# Altium project PD_Controller_Wall_Following_Robo.PrjPcb
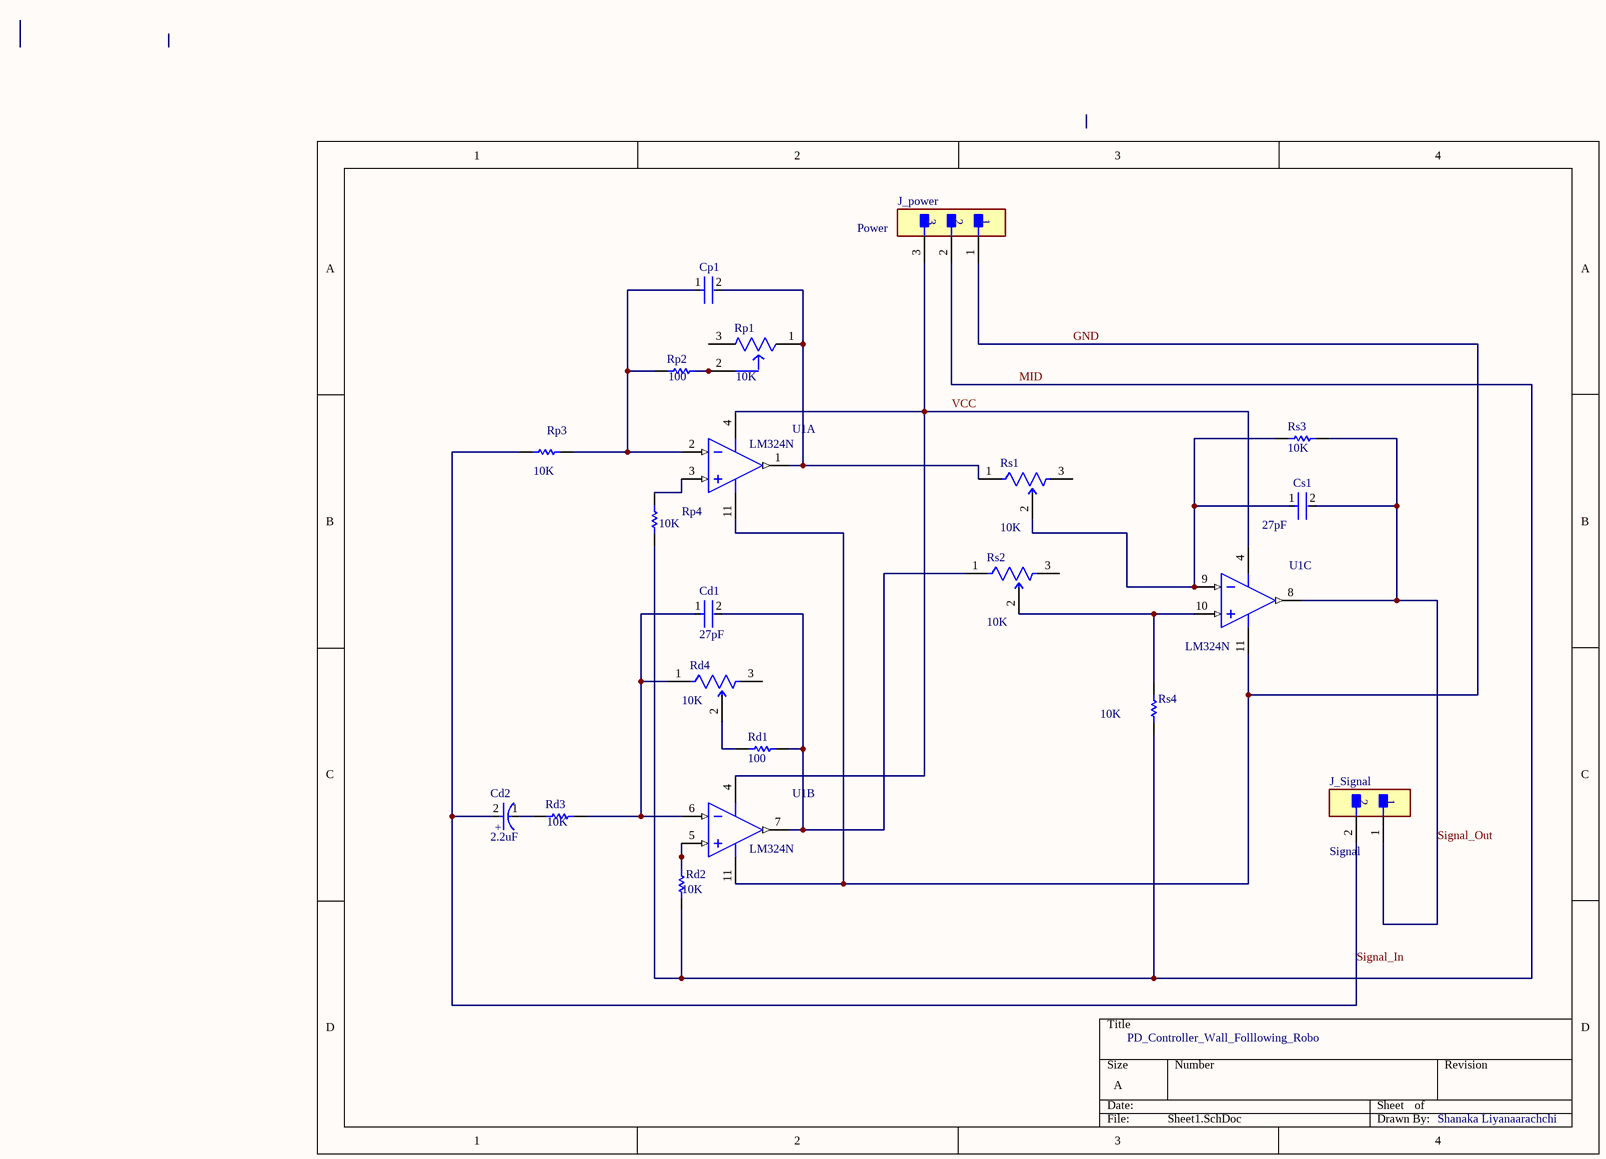
[diagram p0: Sheet1.SchDoc]
1 sheet, 19 parts. Net scope: global (net labels, ports and power ports of the same name join across sheets).
Board file: PD_Controller_Wall_Following_Robo_1.PcbDoc

## Sheet Sheet1.SchDoc
size A; SheetNumber: 1; SheetTotal: 1

### Parts
Cd1  27pF  [FP-RCE0K1-MFG]
Cd2  2.2uF  [FP-RAD-TH-D_5_0_5-L_11_1-MFG]
Cp1  (no value)  [FP-RCE0K1-MFG]
Cs1  27pF  [FP-RCE0K1-MFG]
J_power  Power  [FP-B3B-XH-A_LF_SN-MFG]
J_Signal  Signal  [FP-B2B-XH-A_LF_SN-MFG]
Rd1  100  [RESA60-630X240]
Rd2  10K  [OMTE-RES7X2.5-2]
Rd3  10K  [OMTE-RES7X2.5-2]
Rd4  10K  [FP-3296W-MFG]
Rp1  10K  [FP-3266W-MFG]
Rp2  100  [RESA60-630X240]
Rp3  10K  [OMTE-RES7X2.5-2]
Rp4  10K  [OMTE-RES7X2.5-2]
Rs1  10K  [FP-3296W-MFG]
Rs2  10K  [FP-3296W-MFG]
Rs3  10K  [OMTE-RES7X2.5-2]
Rs4  10K  [OMTE-RES7X2.5-2]
U1  LM324N  [N0014A]  (parts A,B,C of 4)

### Nets
GND: J_power.1 U1.11(GND)
MID: J_power.2 Rd2.1 Rp4.1 Rs4.1
Signal_In: Cd2.2(A) J_Signal.2 Rp3.1
Signal_Out: Cs1.2 J_Signal.1 Rs3.2 U1.8(OUT3)
VCC: J_power.3 U1.4(V+)
NetCd1_1: Cd1.1 Rd3.2 Rd4.1(CCW) U1.6(IN2-)
NetCd1_2: Cd1.2 Rd1.2 Rs2.1(CCW) U1.7(OUT2)
NetCd2_1: Cd2.1(C) Rd3.1
NetCp1_1: Cp1.1 Rp2.1 Rp3.2 U1.2(IN1-)
NetCp1_2: Cp1.2 Rp1.1(CCW) Rs1.1(CCW) U1.1(OUT1)
NetCs1_1: Cs1.1 Rs1.2(WIPER) Rs3.1 U1.9(IN3-)
NetRd1_1: Rd1.1 Rd4.2(WIPER)
NetRd2_2: Rd2.2 U1.5(IN2+)
NetRp1_2: Rp1.2(WIPER) Rp2.2
NetRp4_2: Rp4.2 U1.3(IN1+)
NetRs2_2: Rs2.2(WIPER) Rs4.2 U1.10(IN3+)

Not connected (* = marked no-connect by the designer): Rd4 3(CW); Rp1 3(CW); Rs1 3(CW); Rs2 3(CW)

### Notes on the sheet
- PD_Controller_Wall_Folllowing_Robo
- Shanaka Liyanaarachchi
- (in symbol CMP-05427-000832-1) +

### Library data of the parts
Cd1 Cp1 Cs1 = CMP-06035-026251-1: Cap Ceramic 27pF 50V C0G ±5% Radial 5mm +125°C Automotive Bulk; Lead Diameter: 0.5mm; Lead/Base Style: Formed Leads; Height: 3.5mm; Mount: Through Hole; Height - Seated (Max): 0.138inch; Min Operating Temperature: -55°C; Package Quantity: 1; Width: 0.098inch; Lead Pitch: 0.197inch; Capacitance: 27pF; Voltage Rating: 50V; Max Operating Temperature: 125°C; Case/Package: Radial; Termination: Radial; Voltage Rating (DC): 50V; Packaging: Tape and Reel; Tolerance: 5%; Resistor Type: Ceramic; Dielectric: C0G; Length: 0.142inch; Ratings: AEC-Q200
Cd2 = CMP-05427-000832-1: Aluminum Electrolytic Capacitors (Radial Lead Type) AEC-Q200 Qualified 2.2uF ±20% 50V; Lead/Base Style: Straight; Ripple Current: 18mA; Lead Diameter: 0.5mm; Life (Hours): 1000Hour; Packaging: Tape and Reel; Case/Package: Radial; Tolerance: 20%; Series: NHG; Lead Pitch: 5mm; Package Quantity: 2000; Voltage Rating: 50V; Diameter: 5mm; Length: 11mm; Min Operating Temperature: -55°C; RoHS Compliant: Yes; Voltage Rating (DC): 50V; Height - Seated (Max): 0.472inch; Max Operating Temperature: 105°C; Mount: Through Hole; Radiation Hardening: No; Capacitance: 2.2uF; Height: 11mm; Termination: Radial
J_power = CMP-17439-000014-3: CONN HEADER VERT 3POS 2.5MM; Max Voltage Rating (DC): 250V; Number of Positions: 3; Current Rating: 3A; Gender: Male; Wire/Cable Gauge: 22AWG; Contact Resistance: 20mR; Insulation Resistance: 1GR; Insulation Material: Nylon; Contact Plating: Tin; Depth: 5.75mm; Contact Type: Male Pin; Max Operating Temperature: 85°C; Insulation Color: Natural; Voltage Rating (AC): 250V; Color: Natural; Connector Type: Header; Orientation: Straight; Fastening Type: Detent; Housing Color: White; Min Operating Temperature: -25°C; Termination: Solder; Voltage Rating: 250V; Series: XH; Pitch: 2.5mm; Contact Shape: Square; Number of Rows: 1; Lead Free: Lead Free; Packaging: Bulk; Mount: Through Hole; Flammability Rating: UL94 V-0; Max Voltage Rating (AC): 250V; REACH SVHC: No SVHC; Housing Material: Polyamide; Contact Material: Brass; Lead Pitch: 2.5mm; Contact Finish - Mating: TIN; Length: 9.9mm; Max Current Rating: 3A; Number of Contacts: 3
J_Signal = CMP-2000-05888-3: CONN HEADER VERT 2POS 2.5MM; Current Rating: 3A; Voltage Rating: 250V; Number of Contacts: 2; Contact Resistance: 20mR; Wire/Cable Gauge: 22AWG; Insulation Resistance: 1GR; Connector Type: Male Pin; Packaging: Bulk; Contact Material: Brass; Lead Free: Lead Free; Orientation: Straight; Contact Plating: Tin; Max Current Rating: 3A; Termination: Solder; Fastening Type: Detent; Depth: 5.75mm; Housing Material: Polyamide; REACH SVHC: No SVHC; Series: XH; Voltage Rating (AC): 250V; Number of Positions: 2; Color: Natural; Contact Type: Male Pin; Max Voltage Rating (DC): 250V; Pitch: 2.5mm; Lead Pitch: 2.5mm; Mount: Through Hole; Max Operating Temperature: 85°C; Length: 7.4mm; Max Voltage Rating (AC): 250V; Min Operating Temperature: -25°C; Number of Rows: 1; Housing Color: White
Rd1 Rp2 = CMP-1659-00071-1: Axial Resistor, 100 Ohm, +/- 1%, 0.25 W, -55 to 155 degC, 2-Pin THD, RoHS, Bulk; Voltage Rating: 250 V; Resistance: 4.75 kohm; Power Rating: 250 mW; Type (Resistor): Metal Film; Package Quantity: 200; RoHSCompliant: true; ComponentLink1URL: http://www.yageo.com/; ComponentLink1Description: Manufacturer URL; Case\Package: Axial; ComponentLink2Description: Datasheet; Length: 0.248 inch; PackageReference: MFR-25; Max Operating Temperature: 155 degC; Min Operating Temperature: -55 degC; DatasheetVersion: Apr-13; Mount: Through Hole; PackageDescription: 2-Pin Axial Lead, Dia 2.4 mm, Body Length 6.3 mm; Packaging: Bulk; Tolerance: 1%; ComponentLink2URL: http://www.yageo.com/documents/recent/Yageo%20LR_MFR_2013.pdf
Rd2 Rd3 Rp3 Rp4 Rs3 Rs4 = CMP-2000-06865-1: Little Demon(R) Carbon Composition Molded OD Series, 250 V, 10 KOhm, +/-5%, -70 to 130 degC, 2-Pin THD, RoHS, Bulk; PartNumber: OD103JE; Manufacturer: Ohmite; Power Rating: 0.25W; Power (Watts): 0.25W,1/4W; Tolerance: ±5%; Online Catalog: OD,OF,OASeries,LittleDemon®; Catalog Drawings: OD,OF,OASeries; EDA / CAD Models: DownloadfromAcceleratedDesigns; Mounting Technology: ThroughHole; Datasheet Version: 06/2016; RoHS Information: LittleDemon"E"SeriesMaterialDeclaration; Number of Terminations: 2; Temperature Coefficient: -; Height: -; Resistance (Ohms): 10k; Composition: CarbonComposition; Package Description: 2-Pin THD Resistor, Body 7 x 2.5 mm, Lead Dia. 0.6 mm; Size / Dimension: 0.098"Diax0.276"L(2.50mmx7.00mm); Category: Resistors; Manufacturer URL: http://www.ohmite.com/; Features: PulseWithstanding; Family: ThroughHoleResistors; Supplier Device Package: Axial; Package / Case: Axial; Standard Package: 100; Package Reference: RES7X2.5; Operating Temperature: -; Series: LittleDemon®OD; Datasheet URL: http://www.ohmite.com/cat/res_od_of_oa.pdf; Packaging: Bulk
Rd4 = CMP-07234-000043-1: TRIMMER 50K OHM 0.5W PC PIN TOP; Manufacturer Series: 3296; Resistance Tolerance: 10%; Actuator Orientation: Vertical; Resistance: 50kR; Number of Turns: 25; Power Rating: 500mW; Insulation Resistance: 1GR; Actuator Type: SCREW; Resistance Law: Linear; Number of Terminals/Pins: 3; Temperature Coefficient: 100ppm/°C; Weight: 0.03oz; Length: 9.53mm; Package Quantity: 50; Resistor Type: Cermet; Min Operating Temperature: -55°C; Termination: Pin; Radiation Hardening: No; Terminal Finish: Tin; Height: 0.395inch; Depth: 4.83mm; REACH SVHC: No SVHC; Width: 9.53mm; Packaging: Rail/Tube; RoHS Compliant: Yes; Mount: Panel; Max Power Dissipation: 500mW; Taper: Linear; Color: Blue; Technology: CERMET; Lead Free: Lead Free; Max Operating Temperature: 125°C; Number of Pins: 3; Type: Potentiometer; Military Standard: Not; Contact Plating: Tin; Series: 3296; Tolerance: 10%
Rp1 = CMP-07234-000016-1: TRIMMER 10K OHM 0.25W PC PIN TOP; Manufacturer: Bourns; Manufacturer Part Number: 3266W-1-103LF; Temperature Coefficient: 100ppm/°C; Tolerance: 10%; Value: 10kΩ; Standoff Height: 0.43mm; Device Class L3: Variable Resistors and Potentiometers; ComponentLink2URL: https://www.bourns.com/docs/Product-Datasheets/3266.pdf; ComponentLink2Description: Datasheet; Device Class L2: Resistors; Power Rating: 0.25W; Mouser Description: Trimmer Resistors - Through Hole 1/4 10Kohms 10% SQ W/Standoff Sealed; Category: Res; Digikey Description: TRIMMER 10K OHM 0.25W PC PIN TOP; Device Class L1: Passive Components; Octopart: https://octopart.com/3266w-1-103lf-bourns-81445; Height: 9.02mm; Temperature Range High: +125°C; Series: 3266; Temperature Range Low: -55°C; Composition: Cermet; Resistance: 10kΩ; Lead Free: Yes; RoHS: TRUE; Automotive: No; Package: 3266W; Temperature: -55°C to +125°C
Rs1 Rs2 = CMP-1747-00001-5: TRIMMER 10K OHM 0.5W PC PIN TOP; Power Rating: 500mW; Resistance: 10kR; Tolerance: 10%; Insulation Resistance: 1GR; Number of Turns: 25; Temperature Coefficient: 100ppm/°C; Weight: 0.03oz; Package Quantity: 50; Radiation Hardening: No; Max Power Dissipation: 500mW; Height: 11.55mm; Military Standard: Not; Contact Plating: Tin; Width: 9.53mm; Lead Free: Lead Free; Min Operating Temperature: -55°C; Taper: Linear; RoHS Compliant: Yes; Color: Blue; Depth: 4.83mm; Termination: Pin; Resistor Type: Cermet; Max Operating Temperature: 125°C; Mount: Through Hole; Technology: CERMET; Reach SVHC Compliant: Yes; Packaging: Rail/Tube; Series: 3296; Length: 9.53mm; Resistance Tolerance: 10%
U1 = CMP-0055-00082-3: Low Power Quad Operational Amplifier, 14-pin MDIP; Manufacturer: Texas Instruments; CompType: Amplifiers; PowerWise: N; PackageTopMarking: NSUZXYYTTE#*LM324N; PackageDescription: MDIP, .750 x .250 x.130in, 14 Lead, .100in Pitch; Package Reference: N0014A; RoHS: N; Code_JEDEC: MS-001-AA; ComponentLink1URL: http://www.ti.com/general/docs/lit/getliterature.tsp?genericPartNumber=LM324&fileType=pdf; ComponentLink1Description: Datasheet URL; PinCount: 14